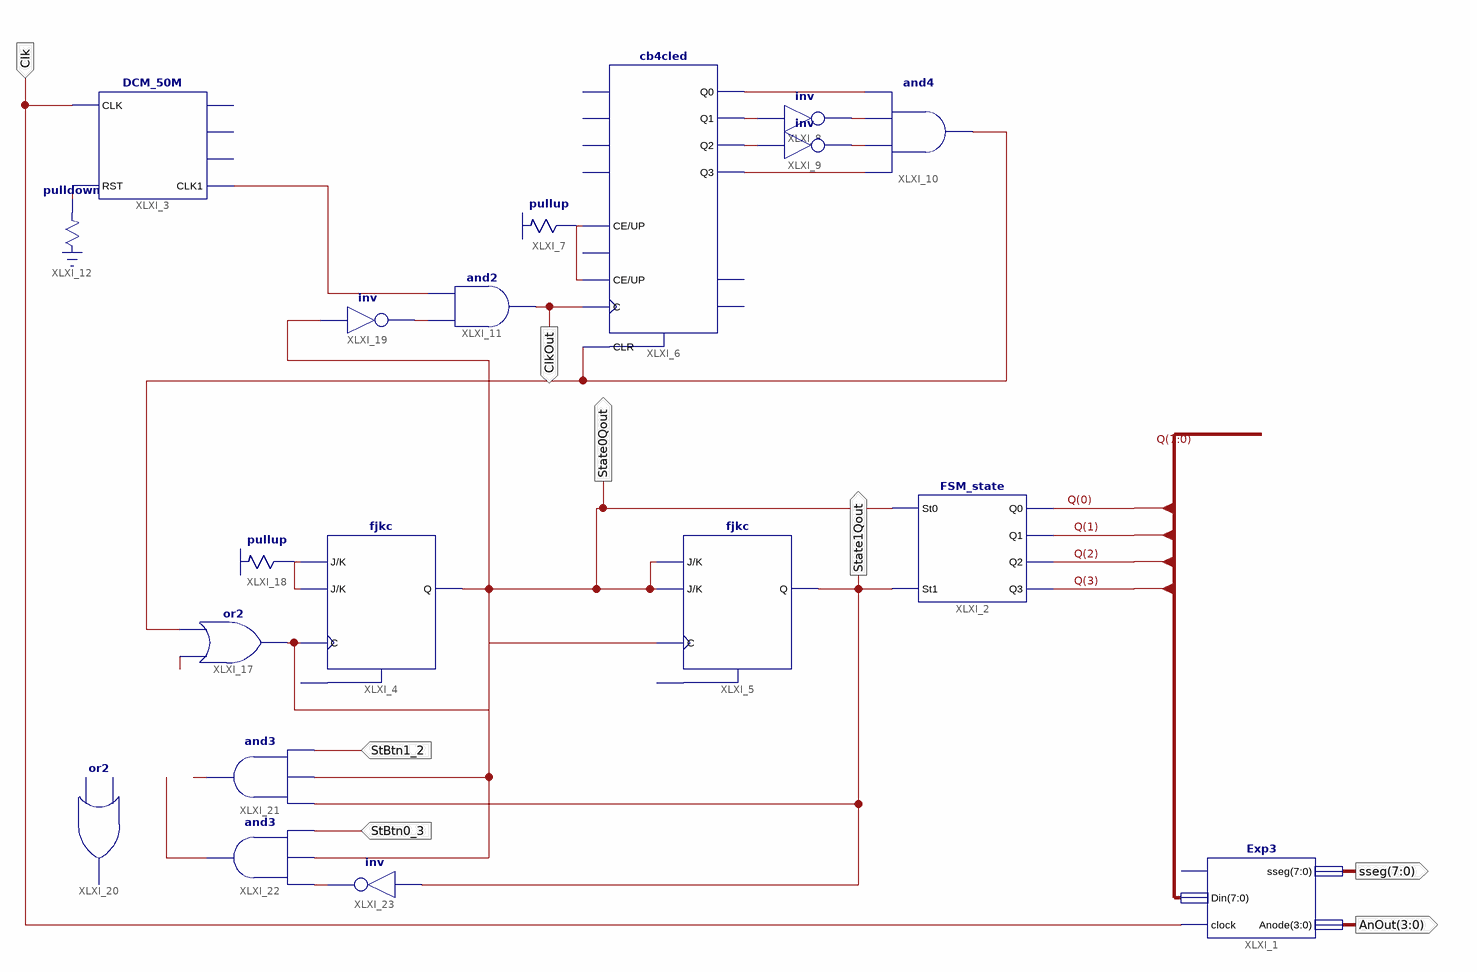
[diagram p0: schematic sheet 1]
// Xilinx ISE schematic Lab9Exp1.sch (spartan3e) as structural Verilog: 19 symbols, 8 ports
module Lab9Exp1 (
  input  StBtn1_2,
  input  StBtn0_3,
  input  Clk,
  output ClkOut,
  output State0Qout,
  output State1Qout,
  output [7:0] sseg,
  output [3:0] AnOut
);

  wire XLXN_1, XLXN_2, XLXN_3, XLXN_4, XLXN_5, XLXN_6, XLXN_7, XLXN_8, XLXN_11, XLXN_12, XLXN_13, XLXN_15,
       XLXN_17, XLXN_20, XLXN_21, XLXN_22, XLXN_24;
  wire [7:0] Q;

  Exp3 XLXI_1 (.Din(Q), .clock(Clk), .sseg(sseg), .Anode(AnOut));  // open: ButtonEn
  FSM_state XLXI_2 (.St0(State0Qout), .St1(State1Qout), .Q0(Q[0]), .Q1(Q[1]), .Q2(Q[2]), .Q3(Q[3]));
  DCM_50M XLXI_3 (.CLK(Clk), .RST(XLXN_11), .CLK1(XLXN_12));  // open: CLK1M, CLK10k, CLK1k
  cb4cled XLXI_6 (
    .C(ClkOut), .CE(XLXN_1), .CLR(XLXN_8), .UP(XLXN_1), .Q0(XLXN_6), .Q1(XLXN_2), .Q2(XLXN_3), .Q3(XLXN_7));  // open: D0, D1, D2, D3, L, CEO, TC
  \pullup  XLXI_7 (.O(XLXN_1));
  not XLXI_8 (XLXN_5, XLXN_2);
  not XLXI_9 (XLXN_4, XLXN_3);
  and XLXI_10 (XLXN_8, XLXN_7, XLXN_4, XLXN_5, XLXN_6);
  and XLXI_11 (ClkOut, XLXN_17, XLXN_12);
  \pulldown  XLXI_12 (.O(XLXN_11));
  fjkc XLXI_4 (.C(XLXN_13), .J(XLXN_15), .K(XLXN_15), .Q(State0Qout));  // open: CLR
  fjkc XLXI_5 (.C(XLXN_13), .J(State0Qout), .K(State0Qout), .Q(State1Qout));  // open: CLR
  or XLXI_17 (XLXN_13, XLXN_20, XLXN_8);
  \pullup  XLXI_18 (.O(XLXN_15));
  not XLXI_19 (XLXN_17, State0Qout);
  or XLXI_20 (XLXN_20, XLXN_22, XLXN_21);
  and XLXI_21 (XLXN_21, StBtn1_2, State0Qout, State1Qout);
  and XLXI_22 (XLXN_22, StBtn0_3, State0Qout, XLXN_24);
  not XLXI_23 (XLXN_24, State1Qout);
endmodule
